# Altium schematic sheet mcu-io.schdoc: MCUB
size A4; Date: 10.25.2025; CheckedBy: BCY; DrawnBy: miaow; DocumentNumber: 13; Revision: v1.1.0; SheetNumber: 13; SheetTotal: 14; BoardType: MAIN_PCB; Desc: IO sub part of MCU
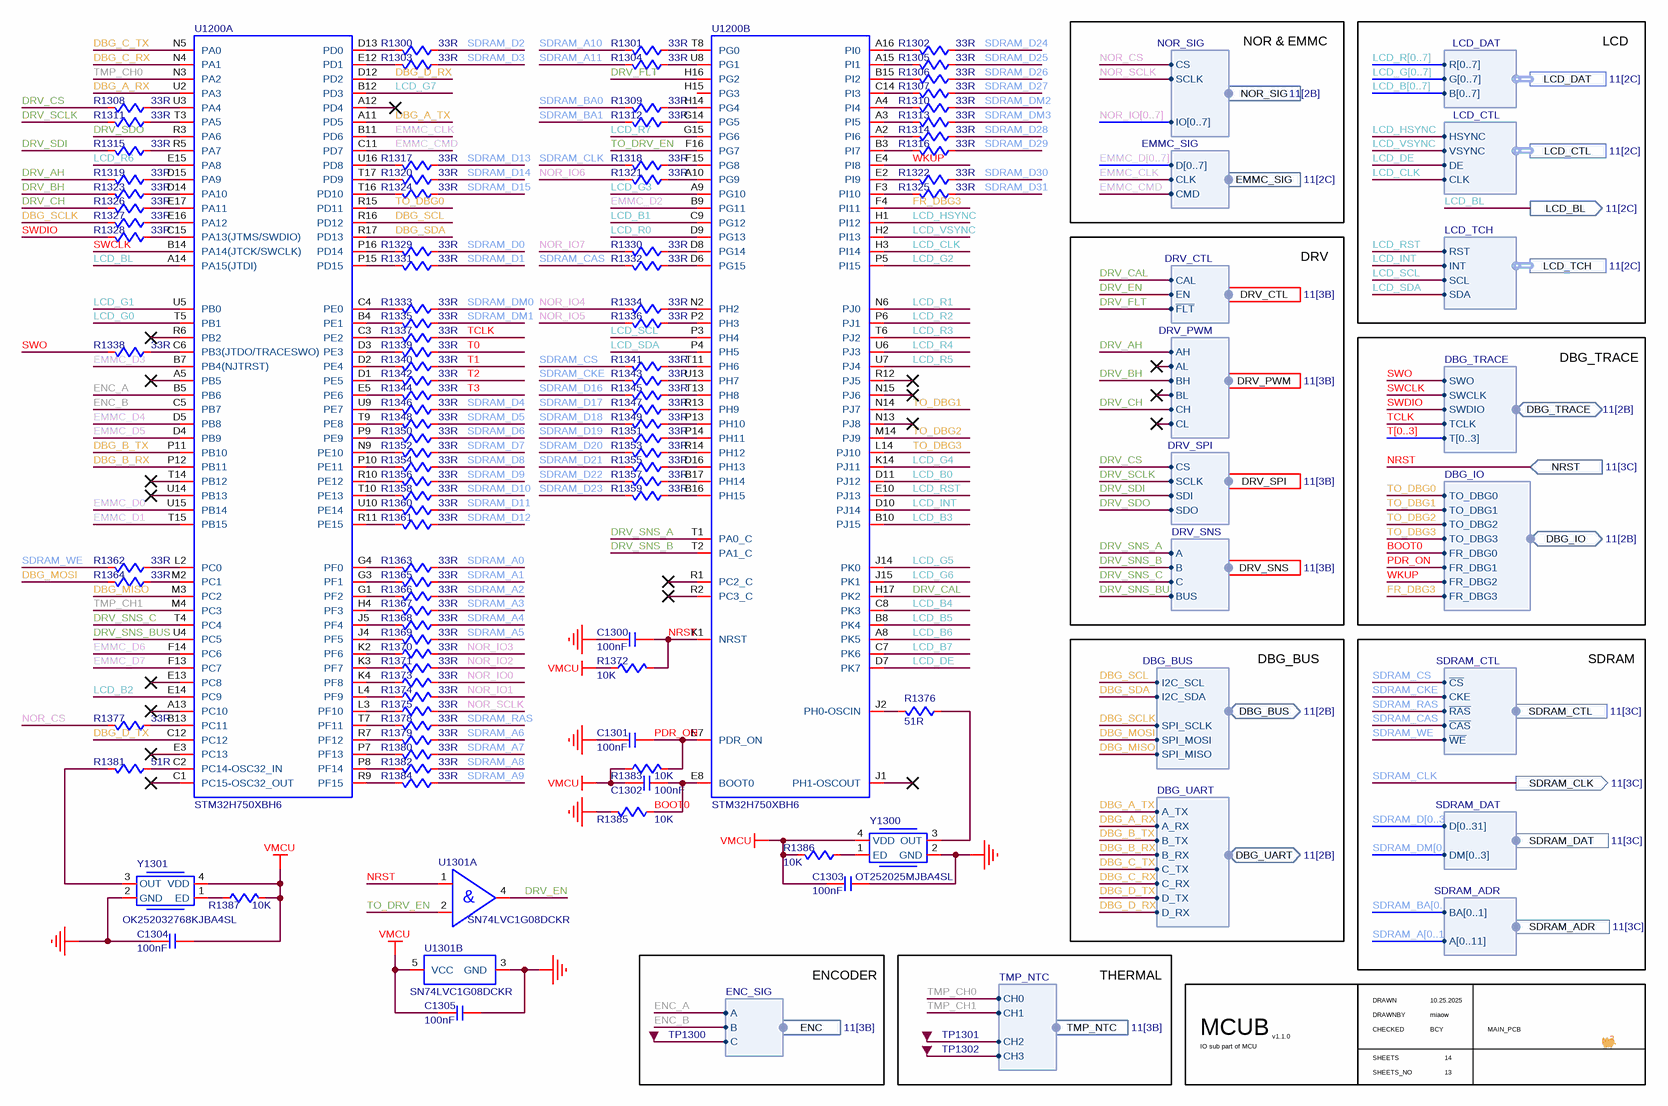
[diagram p0: mcu-io.schdoc]

## Parts
C1300  value 100nF  [C0402]  (hidden comment: C-NOMO)
C1301  value 100nF  [C0402]  (hidden comment: C-NOMO)
C1302  value 100nF  [C0402]  (hidden comment: C-NOMO)
C1303  value 100nF  [C0402]  (hidden comment: C-NOMO)
C1304  value 100nF  [C0402]  (hidden comment: C-NOMO)
C1305  value 100nF  [C0402]  (hidden comment: C-NOMO)
R1300  value 33R  [R0402]  (hidden comment: R)
R1301  value 33R  [R0402]  (hidden comment: R)
R1302  value 33R  [R0402]  (hidden comment: R)
R1303  value 33R  [R0402]  (hidden comment: R)
R1304  value 33R  [R0402]  (hidden comment: R)
R1305  value 33R  [R0402]  (hidden comment: R)
R1306  value 33R  [R0402]  (hidden comment: R)
R1307  value 33R  [R0402]  (hidden comment: R)
R1308  value 33R  [R0402]  (hidden comment: R)
R1309  value 33R  [R0402]  (hidden comment: R)
R1310  value 33R  [R0402]  (hidden comment: R)
R1311  value 33R  [R0402]  (hidden comment: R)
R1312  value 33R  [R0402]  (hidden comment: R)
R1313  value 33R  [R0402]  (hidden comment: R)
R1314  value 33R  [R0402]  (hidden comment: R)
R1315  value 33R  [R0402]  (hidden comment: R)
R1316  value 33R  [R0402]  (hidden comment: R)
R1317  value 33R  [R0402]  (hidden comment: R)
R1318  value 33R  [R0402]  (hidden comment: R)
R1319  value 33R  [R0402]  (hidden comment: R)
R1320  value 33R  [R0402]  (hidden comment: R)
R1321  value 33R  [R0402]  (hidden comment: R)
R1322  value 33R  [R0402]  (hidden comment: R)
R1323  value 33R  [R0402]  (hidden comment: R)
R1324  value 33R  [R0402]  (hidden comment: R)
R1325  value 33R  [R0402]  (hidden comment: R)
R1326  value 33R  [R0402]  (hidden comment: R)
R1327  value 33R  [R0402]  (hidden comment: R)
R1328  value 33R  [R0402]  (hidden comment: R)
R1329  value 33R  [R0402]  (hidden comment: R)
R1330  value 33R  [R0402]  (hidden comment: R)
R1331  value 33R  [R0402]  (hidden comment: R)
R1332  value 33R  [R0402]  (hidden comment: R)
R1333  value 33R  [R0402]  (hidden comment: R)
R1334  value 33R  [R0402]  (hidden comment: R)
R1335  value 33R  [R0402]  (hidden comment: R)
R1336  value 33R  [R0402]  (hidden comment: R)
R1337  value 33R  [R0402]  (hidden comment: R)
R1338  value 33R  [R0402]  (hidden comment: R)
R1339  value 33R  [R0402]  (hidden comment: R)
R1340  value 33R  [R0402]  (hidden comment: R)
R1341  value 33R  [R0402]  (hidden comment: R)
R1342  value 33R  [R0402]  (hidden comment: R)
R1343  value 33R  [R0402]  (hidden comment: R)
R1344  value 33R  [R0402]  (hidden comment: R)
R1345  value 33R  [R0402]  (hidden comment: R)
R1346  value 33R  [R0402]  (hidden comment: R)
R1347  value 33R  [R0402]  (hidden comment: R)
R1348  value 33R  [R0402]  (hidden comment: R)
R1349  value 33R  [R0402]  (hidden comment: R)
R1350  value 33R  [R0402]  (hidden comment: R)
R1351  value 33R  [R0402]  (hidden comment: R)
R1352  value 33R  [R0402]  (hidden comment: R)
R1353  value 33R  [R0402]  (hidden comment: R)
R1354  value 33R  [R0402]  (hidden comment: R)
R1355  value 33R  [R0402]  (hidden comment: R)
R1356  value 33R  [R0402]  (hidden comment: R)
R1357  value 33R  [R0402]  (hidden comment: R)
R1358  value 33R  [R0402]  (hidden comment: R)
R1359  value 33R  [R0402]  (hidden comment: R)
R1360  value 33R  [R0402]  (hidden comment: R)
R1361  value 33R  [R0402]  (hidden comment: R)
R1362  value 33R  [R0402]  (hidden comment: R)
R1363  value 33R  [R0402]  (hidden comment: R)
R1364  value 33R  [R0402]  (hidden comment: R)
R1365  value 33R  [R0402]  (hidden comment: R)
R1366  value 33R  [R0402]  (hidden comment: R)
R1367  value 33R  [R0402]  (hidden comment: R)
R1368  value 33R  [R0402]  (hidden comment: R)
R1369  value 33R  [R0402]  (hidden comment: R)
R1370  value 33R  [R0402]  (hidden comment: R)
R1371  value 33R  [R0402]  (hidden comment: R)
R1372  value 10K  [R0402]  (hidden comment: R)
R1373  value 33R  [R0402]  (hidden comment: R)
R1374  value 33R  [R0402]  (hidden comment: R)
R1375  value 33R  [R0402]  (hidden comment: R)
R1376  value 51R  [R0402]  (hidden comment: R)
R1377  value 33R  [R0402]  (hidden comment: R)
R1378  value 33R  [R0402]  (hidden comment: R)
R1379  value 33R  [R0402]  (hidden comment: R)
R1380  value 33R  [R0402]  (hidden comment: R)
R1381  value 51R  [R0402]  (hidden comment: R)
R1382  value 33R  [R0402]  (hidden comment: R)
R1383  value 10K  [R0402]  (hidden comment: R)
R1384  value 33R  [R0402]  (hidden comment: R)
R1385  value 10K  [R0402]  (hidden comment: R)
R1386  value 10K  [R0402]  (hidden comment: R)
R1387  value 10K  [R0402]  (hidden comment: R)
TP1300  TP  [TP]  (value not drawn)
TP1301  TP  [TP]  (value not drawn)
TP1302  TP  [TP]  (value not drawn)
U1200  STM32H750XBH6  [STM32H750XBH6]  (parts A,B of 3)
U1301  SN74LVC1G08DCKR  [SN74LVC1G08DCKR]  (parts A,B of 2)
Y1300  OT252025MJBA4SL  [OT252025MJBA4SL]
Y1301  OK252032768KJBA4SL  [OK252032768KJBA4SL]

## Blocks framed on the sheet
ENCODER: TP1300
THERMAL: TP1301 TP1302

## Ports
DBG_BUS (bidir, harness DBG_BUS, see 11[2B]), DBG_IO (bidir, harness DBG_IO, see 11[2B]), DBG_TRACE (bidir, harness DBG_TRACE, see 11[2B]), DBG_UART (bidir, harness DBG_UART, see 11[2B]), DRV_CTL (out, harness DRV_CTL, see 11[3B]), DRV_PWM (out, harness DRV_PWM, see 11[3B]), DRV_SNS (out, harness DRV_SNS, see 11[3B]), DRV_SPI (out, harness DRV_SPI, see 11[3B]), EMMC_SIG (in, harness EMMC_SIG, see 11[2C]), ENC (in, harness ENC_SIG, see 11[3B]), LCD_BL (out, see 11[2C]), LCD_CTL (harness LCD_CTL, see 11[2C]), LCD_DAT (harness LCD_DAT, see 11[2C]), LCD_TCH (harness LCD_TCH, see 11[2C]), NOR_SIG (in, harness NOR_SIG, see 11[2B]), NRST (in, see 11[3C]), SDRAM_ADR (harness SDRAM_ADR, see 11[3C]), SDRAM_CLK (out, see 11[3C]), SDRAM_CTL (harness SDRAM_CTL, see 11[3C]), SDRAM_DAT (harness SDRAM_DAT, see 11[3C]), TMP_NTC (in, harness TMP_NTC, see 11[3B])

## Harnesses
SDRAM_DAT: DM[0..3], D[0..31]
SDRAM_ADR: BA[0..1], A[0..11]
SDRAM_CTL: ~{CS}, CKE, ~{RAS}, ~{CAS}, ~{WE}
DRV_CTL: CAL, EN, ~{FLT}
DRV_SNS: C, B, A, BUS
DRV_SPI: CS, SCLK, SDI, SDO
DRV_PWM: AH, AL, BH, BL, CH, CL
LCD_DAT: R[0..7], G[0..7], B[0..7]
LCD_CTL: HSYNC, VSYNC, DE, CLK
LCD_TCH: SDA, SCL, INT, RST
EMMC_SIG: D[0..7], CLK, CMD
NOR_SIG: CS, SCLK, IO[0..7]
DBG_UART: A_TX, A_RX, B_TX, B_RX, C_TX, C_RX, D_TX, D_RX
DBG_BUS: I2C_SDA, I2C_SCL, SPI_MISO, SPI_MOSI, SPI_SCLK
DBG_TRACE: SWO, SWCLK, SWDIO, TCLK, T[0..3]
DBG_IO: TO_DBG0, TO_DBG1, FR_DBG0, TO_DBG3, TO_DBG2, FR_DBG1, FR_DBG2, FR_DBG3
TMP_NTC: CH0, CH1, CH2, CH3
ENC_SIG: A, B, C

## Nets
GND: C1300.2 C1301.2 C1303.2 C1304.2 C1305.2 R1385.1 U1301.3(GND) Y1300.2(GND) Y1301.2(GND)
VMCU: C1302.2 C1303.1 C1304.1 C1305.1 R1372.1 R1383.2 R1386.1 R1387.1 U1301.5(VCC) Y1300.4(VDD) Y1301.4(VDD)
BOOT0: C1302.1 R1385.2 U1200.E8(BOOT0) ; port DBG_IO.FR_DBG0
DBG_A_RX: U1200.U2(PA3) ; port DBG_UART.A_RX
DBG_A_TX: U1200.A11(PD5) ; port DBG_UART.A_TX
DBG_B_RX: U1200.P12(PB11) ; port DBG_UART.B_RX
DBG_B_TX: U1200.P11(PB10) ; port DBG_UART.B_TX
DBG_C_RX: U1200.N4(PA1) ; port DBG_UART.C_RX
DBG_C_TX: U1200.N5(PA0) ; port DBG_UART.C_TX
DBG_D_RX: U1200.D12(PD2) ; port DBG_UART.D_RX
DBG_D_TX: U1200.C12(PC12) ; port DBG_UART.D_TX
DBG_MISO: U1200.M3(PC2) ; port DBG_BUS.SPI_MISO
DBG_MOSI: R1364.2 ; port DBG_BUS.SPI_MOSI
DBG_SCL: U1200.R16(PD12) ; port DBG_BUS.I2C_SCL
DBG_SCLK: R1327.2 ; port DBG_BUS.SPI_SCLK
DBG_SDA: U1200.R17(PD13) ; port DBG_BUS.I2C_SDA
DRV_AH: R1319.2 ; port DRV_PWM.AH
DRV_BH: R1323.2 ; port DRV_PWM.BH
DRV_CAL: U1200.H17(PK2) ; port DRV_CTL.CAL
DRV_CH: R1326.2 ; port DRV_PWM.CH
DRV_CS: R1308.2 ; port DRV_SPI.CS
DRV_EN: U1301.4(Y) ; port DRV_CTL.EN
DRV_FLT: U1200.H16(PG2) ; port DRV_CTL.~{FLT}
DRV_SCLK: R1311.2 ; port DRV_SPI.SCLK
DRV_SDI: R1315.2 ; port DRV_SPI.SDI
DRV_SDO: U1200.R3(PA6) ; port DRV_SPI.SDO
DRV_SNS_A: U1200.T1(PA0_C) ; port DRV_SNS.A
DRV_SNS_B: U1200.T2(PA1_C) ; port DRV_SNS.B
DRV_SNS_BUS: U1200.U4(PC5) ; port DRV_SNS.BUS
DRV_SNS_C: U1200.T4(PC4) ; port DRV_SNS.C
EMMC_CLK: U1200.B11(PD6) ; port EMMC_SIG.CLK
EMMC_CMD: U1200.C11(PD7) ; port EMMC_SIG.CMD
EMMC_D0: U1200.U15(PB14)
EMMC_D1: U1200.T15(PB15)
EMMC_D2: U1200.B9(PG11)
EMMC_D3: U1200.B7(PB4(NJTRST))
EMMC_D4: U1200.D5(PB8)
EMMC_D5: U1200.D4(PB9)
EMMC_D6: U1200.F14(PC6)
EMMC_D7: U1200.F13(PC7)
ENC_A: U1200.B5(PB6) ; port ENC.A
ENC_B: U1200.C5(PB7) ; port ENC.B
FR_DBG3: U1200.F4(PI11) ; port DBG_IO.FR_DBG3
LCD_B0: U1200.D11(PJ12)
LCD_B1: U1200.C9(PG12)
LCD_B2: U1200.E14(PC9)
LCD_B3: U1200.B10(PJ15)
LCD_B4: U1200.C8(PK3)
LCD_B5: U1200.B8(PK4)
LCD_B6: U1200.A8(PK5)
LCD_B7: U1200.C7(PK6)
LCD_BL: U1200.A14(PA15(JTDI)) ; port LCD_BL
LCD_CLK: U1200.H3(PI14) ; port LCD_CTL.CLK
LCD_DE: U1200.D7(PK7) ; port LCD_CTL.DE
LCD_G0: U1200.T5(PB1)
LCD_G1: U1200.U5(PB0)
LCD_G2: U1200.P5(PI15)
LCD_G3: U1200.A9(PG10)
LCD_G4: U1200.K14(PJ11)
LCD_G5: U1200.J14(PK0)
LCD_G6: U1200.J15(PK1)
LCD_G7: U1200.B12(PD3)
LCD_HSYNC: U1200.H1(PI12) ; port LCD_CTL.HSYNC
LCD_INT: U1200.D10(PJ14) ; port LCD_TCH.INT
LCD_R0: U1200.D9(PG13)
LCD_R1: U1200.N6(PJ0)
LCD_R2: U1200.P6(PJ1)
LCD_R3: U1200.T6(PJ2)
LCD_R4: U1200.U6(PJ3)
LCD_R5: U1200.U7(PJ4)
LCD_R6: U1200.E15(PA8)
LCD_R7: U1200.G15(PG6)
LCD_RST: U1200.E10(PJ13) ; port LCD_TCH.RST
LCD_SCL: U1200.P3(PH4) ; port LCD_TCH.SCL
LCD_SDA: U1200.P4(PH5) ; port LCD_TCH.SDA
LCD_VSYNC: U1200.H2(PI13) ; port LCD_CTL.VSYNC
NOR_CS: R1377.2 ; port NOR_SIG.CS
NOR_IO0: R1373.2
NOR_IO1: R1374.2
NOR_IO2: R1371.2
NOR_IO3: R1370.2
NOR_IO4: R1334.2
NOR_IO5: R1336.2
NOR_IO6: R1321.2
NOR_IO7: R1330.2
NOR_SCLK: R1375.2 ; port NOR_SIG.SCLK
NRST: C1300.1 R1372.2 U1200.K1(NRST) U1301.1(A) ; port NRST
PDR_ON: C1301.1 R1383.1 U1200.E7(PDR_ON) ; port DBG_IO.FR_DBG1
SDRAM_A0: R1363.2
SDRAM_A1: R1365.2
SDRAM_A2: R1366.2
SDRAM_A3: R1367.2
SDRAM_A4: R1368.2
SDRAM_A5: R1369.2
SDRAM_A6: R1379.2
SDRAM_A7: R1380.2
SDRAM_A8: R1382.2
SDRAM_A9: R1384.2
SDRAM_A10: R1301.2
SDRAM_A11: R1304.2
SDRAM_BA0: R1309.2
SDRAM_BA1: R1312.2
SDRAM_CAS: R1332.2 ; port SDRAM_CTL.~{CAS}
SDRAM_CKE: R1343.2 ; port SDRAM_CTL.CKE
SDRAM_CLK: R1318.2 ; port SDRAM_CLK
SDRAM_CS: R1341.2 ; port SDRAM_CTL.~{CS}
SDRAM_D0: R1329.2
SDRAM_D1: R1331.2
SDRAM_D2: R1300.2
SDRAM_D3: R1303.2
SDRAM_D4: R1346.2
SDRAM_D5: R1348.2
SDRAM_D6: R1350.2
SDRAM_D7: R1352.2
SDRAM_D8: R1354.2
SDRAM_D9: R1356.2
SDRAM_D10: R1358.2
SDRAM_D11: R1360.2
SDRAM_D12: R1361.2
SDRAM_D13: R1317.2
SDRAM_D14: R1320.2
SDRAM_D15: R1324.2
SDRAM_D16: R1345.2
SDRAM_D17: R1347.2
SDRAM_D18: R1349.2
SDRAM_D19: R1351.2
SDRAM_D20: R1353.2
SDRAM_D21: R1355.2
SDRAM_D22: R1357.2
SDRAM_D23: R1359.2
SDRAM_D24: R1302.2
SDRAM_D25: R1305.2
SDRAM_D26: R1306.2
SDRAM_D27: R1307.2
SDRAM_D28: R1314.2
SDRAM_D29: R1316.2
SDRAM_D30: R1322.2
SDRAM_D31: R1325.2
SDRAM_DM0: R1333.2
SDRAM_DM1: R1335.2
SDRAM_DM2: R1310.2
SDRAM_DM3: R1313.2
SDRAM_RAS: R1378.2 ; port SDRAM_CTL.~{RAS}
SDRAM_WE: R1362.2 ; port SDRAM_CTL.~{WE}
SWCLK: U1200.B14(PA14(JTCK/SWCLK)) ; port DBG_TRACE.SWCLK
SWDIO: R1328.2 ; port DBG_TRACE.SWDIO
SWO: R1338.2 ; port DBG_TRACE.SWO
T0: R1339.2
T1: R1340.2
T2: R1342.2
T3: R1344.2
TCLK: R1337.2 ; port DBG_TRACE.TCLK
TMP_CH0: U1200.N3(PA2) ; port TMP_NTC.CH0
TMP_CH1: U1200.M4(PC3) ; port TMP_NTC.CH1
TO_DBG0: U1200.R15(PD11) ; port DBG_IO.TO_DBG0
TO_DBG1: U1200.N14(PJ7) ; port DBG_IO.TO_DBG1
TO_DBG2: U1200.M14(PJ9) ; port DBG_IO.TO_DBG2
TO_DBG3: U1200.L14(PJ10) ; port DBG_IO.TO_DBG3
TO_DRV_EN: U1200.F16(PG7) U1301.2(B)
WKUP: U1200.E4(PI8) ; port DBG_IO.FR_DBG2
NetR1300_1: R1300.1 U1200.D13(PD0)
NetR1301_1: R1301.1 U1200.T8(PG0)
NetR1302_1: R1302.1 U1200.A16(PI0)
NetR1303_1: R1303.1 U1200.E12(PD1)
NetR1304_1: R1304.1 U1200.U8(PG1)
NetR1305_1: R1305.1 U1200.A15(PI1)
NetR1306_1: R1306.1 U1200.B15(PI2)
NetR1307_1: R1307.1 U1200.C14(PI3)
NetR1308_1: R1308.1 U1200.U3(PA4)
NetR1309_1: R1309.1 U1200.H14(PG4)
NetR1310_1: R1310.1 U1200.A4(PI4)
NetR1311_1: R1311.1 U1200.T3(PA5)
NetR1312_1: R1312.1 U1200.G14(PG5)
NetR1313_1: R1313.1 U1200.A3(PI5)
NetR1314_1: R1314.1 U1200.A2(PI6)
NetR1315_1: R1315.1 U1200.R5(PA7)
NetR1316_1: R1316.1 U1200.B3(PI7)
NetR1317_1: R1317.1 U1200.U16(PD8)
NetR1318_1: R1318.1 U1200.F15(PG8)
NetR1319_1: R1319.1 U1200.D15(PA9)
NetR1320_1: R1320.1 U1200.T17(PD9)
NetR1321_1: R1321.1 U1200.A10(PG9)
NetR1322_1: R1322.1 U1200.E2(PI9)
NetR1323_1: R1323.1 U1200.D14(PA10)
NetR1324_1: R1324.1 U1200.T16(PD10)
NetR1325_1: R1325.1 U1200.F3(PI10)
NetR1326_1: R1326.1 U1200.E17(PA11)
NetR1327_1: R1327.1 U1200.E16(PA12)
NetR1328_1: R1328.1 U1200.C15(PA13(JTMS/SWDIO))
NetR1329_1: R1329.1 U1200.P16(PD14)
NetR1330_1: R1330.1 U1200.D8(PG14)
NetR1331_1: R1331.1 U1200.P15(PD15)
NetR1332_1: R1332.1 U1200.D6(PG15)
NetR1333_1: R1333.1 U1200.C4(PE0)
NetR1334_1: R1334.1 U1200.N2(PH2)
NetR1335_1: R1335.1 U1200.B4(PE1)
NetR1336_1: R1336.1 U1200.P2(PH3)
NetR1337_1: R1337.1 U1200.C3(PE2)
NetR1338_1: R1338.1 U1200.C6(PB3(JTDO/TRACESWO))
NetR1339_1: R1339.1 U1200.D3(PE3)
NetR1340_1: R1340.1 U1200.D2(PE4)
NetR1341_1: R1341.1 U1200.T11(PH6)
NetR1342_1: R1342.1 U1200.D1(PE5)
NetR1343_1: R1343.1 U1200.U13(PH7)
NetR1344_1: R1344.1 U1200.E5(PE6)
NetR1345_1: R1345.1 U1200.T13(PH8)
NetR1346_1: R1346.1 U1200.U9(PE7)
NetR1347_1: R1347.1 U1200.R13(PH9)
NetR1348_1: R1348.1 U1200.T9(PE8)
NetR1349_1: R1349.1 U1200.P13(PH10)
NetR1350_1: R1350.1 U1200.P9(PE9)
NetR1351_1: R1351.1 U1200.P14(PH11)
NetR1352_1: R1352.1 U1200.N9(PE10)
NetR1353_1: R1353.1 U1200.R14(PH12)
NetR1354_1: R1354.1 U1200.P10(PE11)
NetR1355_1: R1355.1 U1200.D16(PH13)
NetR1356_1: R1356.1 U1200.R10(PE12)
NetR1357_1: R1357.1 U1200.B17(PH14)
NetR1358_1: R1358.1 U1200.T10(PE13)
NetR1359_1: R1359.1 U1200.B16(PH15)
NetR1360_1: R1360.1 U1200.U10(PE14)
NetR1361_1: R1361.1 U1200.R11(PE15)
NetR1362_1: R1362.1 U1200.L2(PC0)
NetR1363_1: R1363.1 U1200.G4(PF0)
NetR1364_1: R1364.1 U1200.M2(PC1)
NetR1365_1: R1365.1 U1200.G3(PF1)
NetR1366_1: R1366.1 U1200.G1(PF2)
NetR1367_1: R1367.1 U1200.H4(PF3)
NetR1368_1: R1368.1 U1200.J5(PF4)
NetR1369_1: R1369.1 U1200.J4(PF5)
NetR1370_1: R1370.1 U1200.K2(PF6)
NetR1371_1: R1371.1 U1200.K3(PF7)
NetR1373_1: R1373.1 U1200.K4(PF8)
NetR1374_1: R1374.1 U1200.L4(PF9)
NetR1375_1: R1375.1 U1200.L3(PF10)
NetR1376_1: R1376.1 U1200.J2(PH0-OSCIN)
NetR1376_2: R1376.2 Y1300.3(OUT)
NetR1377_1: R1377.1 U1200.B13(PC11)
NetR1378_1: R1378.1 U1200.T7(PF11)
NetR1379_1: R1379.1 U1200.R7(PF12)
NetR1380_1: R1380.1 U1200.P7(PF13)
NetR1381_1: R1381.1 Y1301.3(OUT)
NetR1381_2: R1381.2 U1200.C2(PC14-OSC32_IN)
NetR1382_1: R1382.1 U1200.P8(PF14)
NetR1384_1: R1384.1 U1200.R9(PF15)
NetR1386_2: R1386.2 Y1300.1(ED)
NetR1387_2: R1387.2 Y1301.1(ED)
NetTP1300_0: TP1300.0 ; port ENC.C
NetTP1301_0: TP1301.0 ; port TMP_NTC.CH2
NetTP1302_0: TP1302.0 ; port TMP_NTC.CH3

Not connected (* = marked no-connect by the designer): U1200 A5(PB5)* A12(PD4)* A13(PC10)* C1(PC15-OSC32_OUT)* E3(PC13)* E13(PC8)* H15(PG3) J1(PH1-OSCOUT)* N13(PJ8)* N15(PJ6)* R1(PC2_C)* R2(PC3_C)* R6(PB2)* R12(PJ5)* T14(PB12)* U14(PB13)*

## Buses and harness runs
bus EMMC_D[0..7]
bus LCD_B[0..7]
bus LCD_G[0..7]
bus LCD_R[0..7]
bus NOR_IO[0..7]
bus SDRAM_A[0..11]
bus SDRAM_BA[0..1]
bus SDRAM_D[0..31]
bus SDRAM_DM[0..3]
bus T[0..3]

## Notes on the sheet
- NOR & EMMC
- LCD
- DRV
- DBG_TRACE
- DBG_BUS
- SDRAM
- DRAWN
- CHECKED
- DRAWNBY
- SHEETS
- SHEETS_NO
- (in symbol SN74LVC1G08DCKR, part A) &

## Library data of the parts
C1300-C1305 = C-NOMO: voltage: 25V; precision: 5%
R1300-R1387 = R: precision: 1%
U1200 = STM32H750XBH6: MCU; Supplier 1: LCSC; Supplier Part Number 1: C405932
U1301 = SN74LVC1G08DCKR: AND GATE  - 1bit; Supplier 1: LCSC; Supplier Part Number 1: C7832
Y1300 = OT252025MJBA4SL: value: 25MHz; Supplier 1: LCSC; Supplier Part Number 1: C717683
Y1301 = OK252032768KJBA4SL: value: 32.768KHz; Supplier 1: LCSC; Supplier Part Number 1: C669098